# EAGLE design ATmega168 Temp Sensor - Remote Unit (EAGLE 5.06)
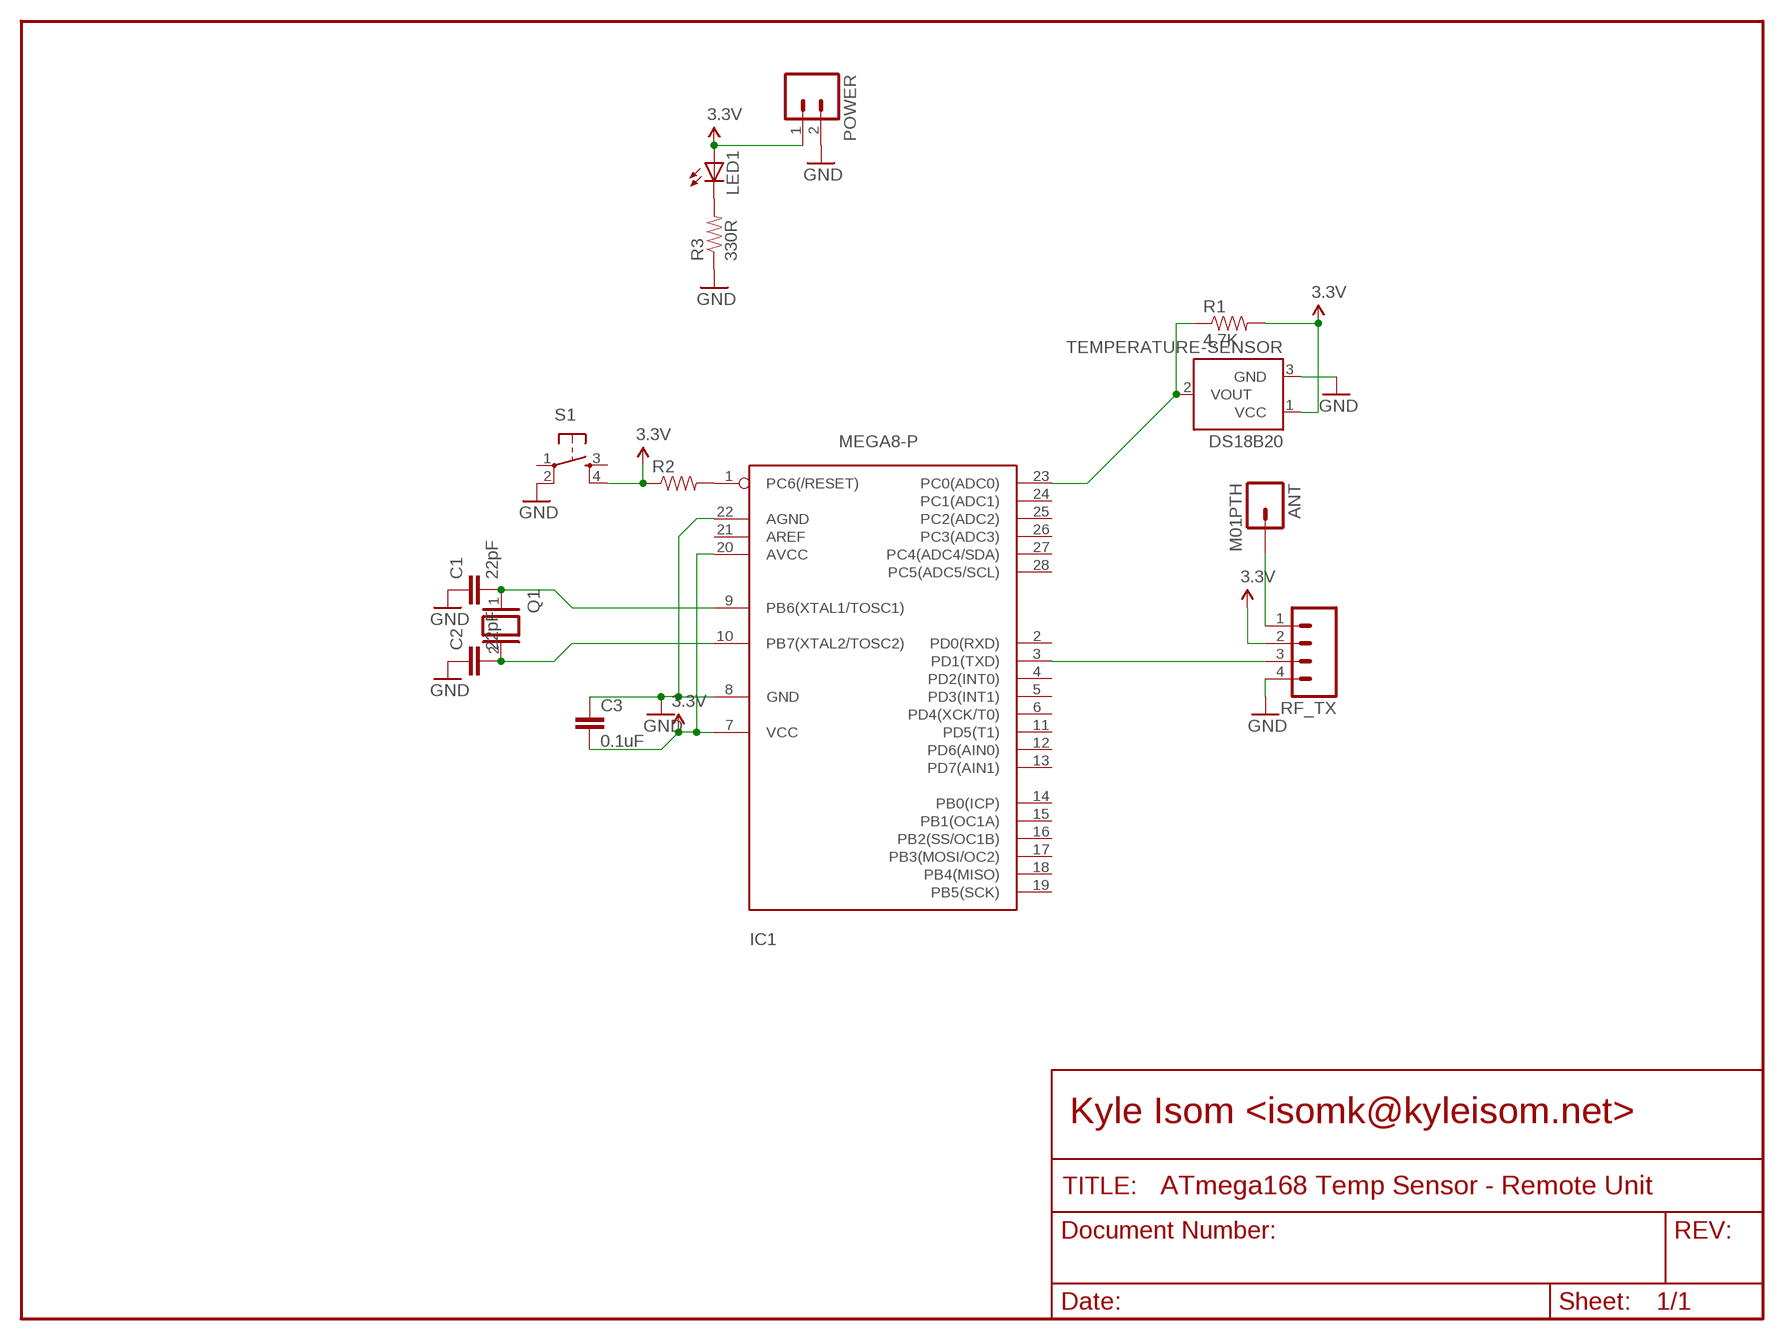
[diagram p0: schematic, sheet 1]

## Parts
ANT  M01PTH  [1X01]
C1  22pF  CAPPTH1  [CAP-PTH-5MM]
C2  22pF  CAPPTH1  [CAP-PTH-5MM]
C3  0.1uF  CAPPTH1  [CAP-PTH-5MM]
DS18B20  TEMPERATURE-SENSOR  [TO-92]
IC1  MEGA8-P  [DIL28-3]
LED1  LED3MM  [LED3MM]
POWER  M02LOCK  [1X02_LOCK]
Q1  XTAL/S  [QS]
R1  4.7K  RESISTORPTH1  [AXIAL-0.3]
R2  RESISTORPTH1  [AXIAL-0.3]
R3  330R  RESISTORPTH1  [AXIAL-0.3]
RF_TX  M04LOCK  [1X04_LOCK]
S1  TAC_SWITCHPTH  [TACTILE-PTH]

## Nets
3.3V: C3.2 DS18B20.1(VCC) IC1.7(VCC) IC1.20(AVCC) LED1.A POWER.1 R1.P$2 R2.P$1 RF_TX.2 S1.4
GND: C1.1 C2.1 C3.1 DS18B20.3(GND) IC1.8(GND) IC1.22(AGND) POWER.2 R3.P$1 RF_TX.4 S1.2
N$1: IC1.3(PD1(TXD)) RF_TX.3
N$2: C1.2 IC1.9(PB6(XTAL1/TOSC1)) Q1.1
N$3: C2.2 IC1.10(PB7(XTAL2/TOSC2)) Q1.2
N$4: ANT.1 RF_TX.1
N$5: IC1.1(PC6(/RESET)) R2.P$2
N$7: DS18B20.2(VOUT) IC1.23(PC0(ADC0)) R1.P$1
N$8: LED1.K(C) R3.P$2
Unconnected: IC1.2(PD0(RXD)) IC1.4(PD2(INT0)) IC1.5(PD3(INT1)) IC1.6(PD4(XCK/T0)) IC1.11(PD5(T1)) IC1.12(PD6(AIN0)) IC1.13(PD7(AIN1)) IC1.14(PB0(ICP)) IC1.15(PB1(OC1A)) IC1.16(PB2(SS/OC1B)) IC1.17(PB3(MOSI/OC2)) IC1.18(PB4(MISO)) IC1.19(PB5(SCK)) IC1.21(AREF) IC1.24(PC1(ADC1)) IC1.25(PC2(ADC2)) IC1.26(PC3(ADC3)) IC1.27(PC4(ADC4/SDA)) IC1.28(PC5(ADC5/SCL)) S1.1 S1.3

## Notes on the sheet
- Kyle Isom <isomk@kyleisom.net>

## Library data of the parts
ANT = SparkFun:M01: Header 1 Standard 1-pin 0.1" header. Use with straight break away headers (SKU : PRT-00116), right angle break away headers (PRT-00553), swiss pins (PRT-00743), machine pins (PRT-00117), and female headers (PRT-00115).
C1-C3 = SparkFun:CAP: Capacitor Standard 0603 ceramic capacitor, and 0.1" leaded capacitor.
DS18B20 = SparkFun:TEMPERATURE-SENSOR
IC1 = avr-6:MEGA8-P: MICROCONTROLLER 8 Kbytes FLASH 1 kbytes SRAM 512 bytes EEPROM USART 4-channel 10 bit ADC 2-channel 8 bit ADC
LED1 = led:LED: LED OSRAM: - CHIPLED LG R971, LG N971, LY N971, LG Q971, LY Q971, LO R971, LY R971 LH N974, LH R974 LS Q976, LO Q976, LY Q976 LO Q996 - Hyper CHIPLED LW Q18S LB Q993, LB Q99A, LB R99A - SideLED LS A670, LO A670, LY A670, LG A670, LP A670 LB A673, LV A673, LT A673, LW A673 LH A674 LY A675 LS A676, LA A676, LO A676, LY A676, LW A676 LS A679, LY A679, LG A679 - Hyper Micro SIDELED® LS Y876, LA Y876, LO Y876, LY Y876 LT Y87S - SmartLED LW L88C, LW L88S LB L89C, LB L89S, LG L890 LS L89K, LO L89K, LY L89K LS L896, LA L896, LO L896, LY L896 - TOPLED LS T670, LO T670, LY T670, LG T670, LP T670 LSG T670, LSP T670, LSY T670, LOP T670, LYG T670 LG T671, LOG T671, LSG T671 LB T673, LV T673, LT T673, LW T673 LH T674 LS T676, LA T676, LO T676, LY T676, LB T676, LH T676, LSB T676, LW T676 LB T67C, LV T67C, LT T67C, LS T67K, LO T67K, LY T67K, LW E67C LS E67B, LA E67B, LO E67B, LY E67B, LB E67C, LV E67C, LT E67C LW T67C LS T679, LY T679, LG T679 LS T770, LO T770, LY T770, LG T770, LP T770 LB T773, LV T773, LT T773, LW T773 LH T774 LS E675, LA E675, LY E675, LS T675 LS T776, LA T776, LO T776, LY T776, LB T776 LHGB T686 LT T68C, LB T68C - Hyper Mini TOPLED® LB M676 - Mini TOPLED Santana® LG M470 LS M47K, LO M47K, LY M47K Source: http://www.osram.convergy.de LUXEON: - LUMILED® LXK2-PW12-R00, LXK2-PW12-S00, LXK2-PW14-U00, LXK2-PW14-V00 LXK2-PM12-R00, LXK2-PM12-S00, LXK2-PM14-U00 LXK2-PE12-Q00, LXK2-PE12-R00, LXK2-PE12-S00, LXK2-PE14-T00, LXK2-PE14-U00 LXK2-PB12-K00, LXK2-PB12-L00, LXK2-PB12-M00, LXK2-PB14-N00, LXK2-PB14-P00, LXK2-PB14-Q00 LXK2-PR12-L00, LXK2-PR12-M00, LXK2-PR14-Q00, LXK2-PR14-R00 LXK2-PD12-Q00, LXK2-PD12-R00, LXK2-PD12-S00 LXK2-PH12-R00, LXK2-PH12-S00 LXK2-PL12-P00, LXK2-PL12-Q00, LXK2-PL12-R00 Source: www.luxeon.com KINGBRIGHT: KA-3528ASYC Source: www.kingbright.com
POWER = SparkFun:M02: Header 2 Standard 2-pin 0.1" header. Use with straight break away headers (SKU : PRT-00116), right angle break away headers (PRT-00553), swiss pins (PRT-00743), machine pins (PRT-00117), and female headers (PRT-00115). Molex polarized connector foot print use with SKU : PRT-08233 with associated crimp pins and housings.
Q1 = special:XTAL/S: CRYSTAL
R1-R3 = SparkFun:RESISTOR: Resistor Basic schematic elements and footprints for 0603, 1206, and PTH 1/10th watt (small) resistors.
RF_TX = SparkFun:M04: Header 4 Standard 4-pin 0.1" header. Use with straight break away headers (SKU : PRT-00116), right angle break away headers (PRT-00553), swiss pins (PRT-00743), machine pins (PRT-00117), and female headers (PRT-00115). Molex polarized connector foot print use with SKU : PRT-08231 with associated crimp pins and housings.
S1 = SparkFun:TAC_SWITCH: Momentary Switch Button commonly used for reset or general input. Spark Fun Electronics SKU : COM-00097

## Board
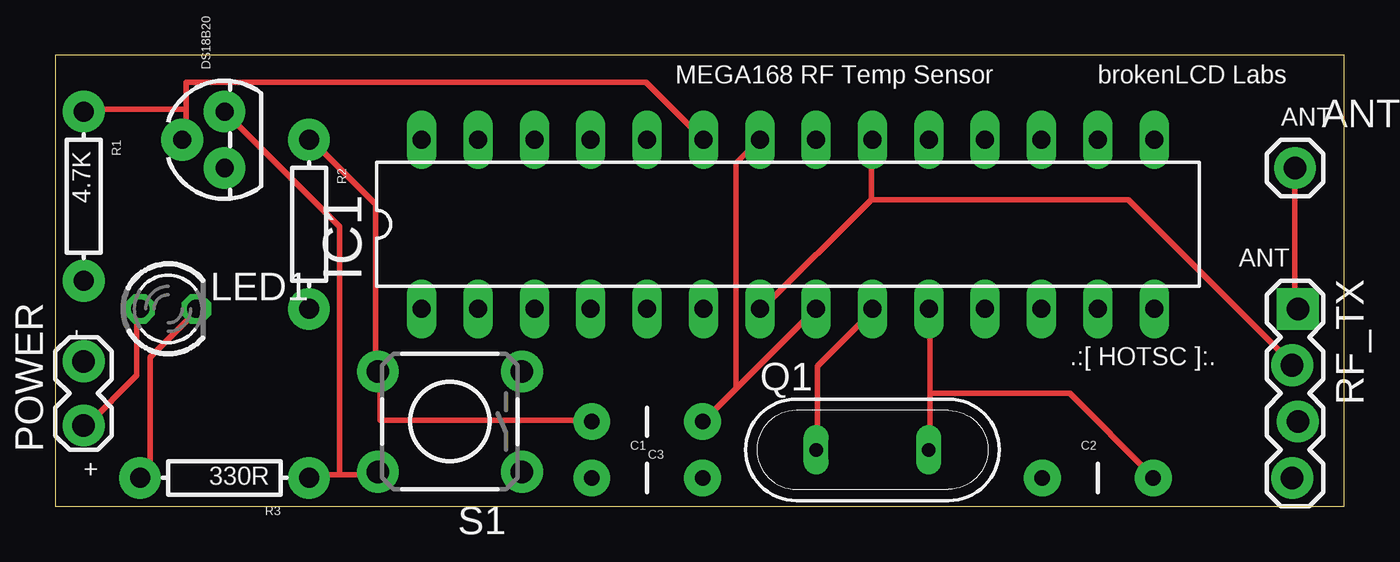
[diagram p1: board, top side]
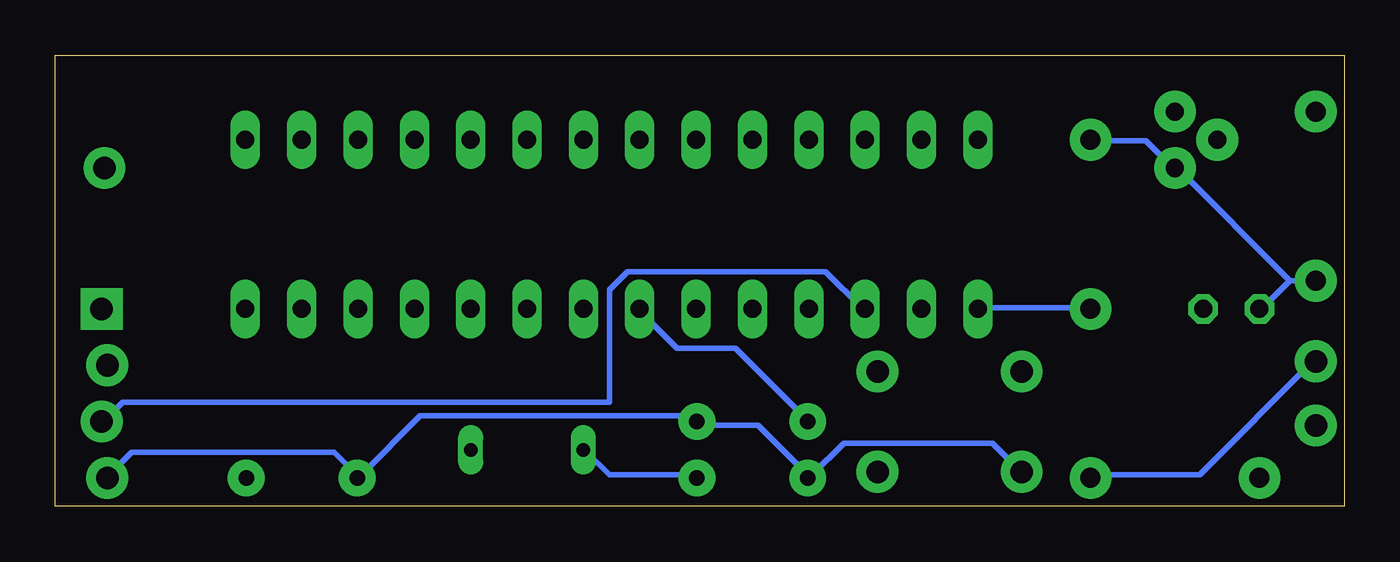
[diagram p2: board, bottom side, seen from below]

Size 58.09 x 20.31 mm. Coordinates in mm from the lower left corner, seen from the top.
Outline: 0,0 58.09,0 58.09,20.31 0,20.31 0,0
Copper layers (1*16): Top 0.035mm / dielectric 1.5mm / Bottom 0.035mm
Design rules "default": minimum track width 10mil, minimum drill 24mil, track to track 8mil, track to pad 8mil, pad to pad 8mil, via to via 8mil, smd to smd 8mil, copper to edge 40mil, drill to drill 8mil, minimum pad ring 10mil, minimum via ring 8mil, stop-mask expansion 4mil, vias tented up to drill 0mil, thermal gap 10mil

### Footprints (pad centres in the part's own frame; a part is rotated, then mirrored left to right if it is on the bottom)
1X01 = drill 1.016 pad 1.88 round: 1 0,0
CAP-PTH-5MM = drill 0.7 pad 1.651 round: 1 -2.5,0; 2 2.5,0
TO-92 = drill 0.813 pad 1.88 round: 1 -1.27,0; 2 0,1.905; 3 1.27,0
DIL28-3 = drill 0.813 long: 1 -16.51,-3.81; 2 -13.97,-3.81; 3 -11.43,-3.81; 4 -8.89,-3.81; 5 -6.35,-3.81; 6 -3.81,-3.81; 7 -1.27,-3.81; 8 1.27,-3.81; 9 3.81,-3.81; 10 6.35,-3.81; 11 8.89,-3.81; 12 11.43,-3.81; 13 13.97,-3.81; 14 16.51,-3.81; 15 16.51,3.81; 16 13.97,3.81; 17 11.43,3.81; 18 8.89,3.81; 19 6.35,3.81; 20 3.81,3.81; 21 1.27,3.81; 22 -1.27,3.81; 23 -3.81,3.81; 24 -6.35,3.81; 25 -8.89,3.81; 26 -11.43,3.81; 27 -13.97,3.81; 28 -16.51,3.81
LED3MM = drill 0.813 octagon: A -1.27,0; K 1.27,0
1X02_LOCK = drill 1.016 pad 1.88 round: 1 -0.178,0; 2 2.718,0
QS = drill 0.61 long: 1 -2.54,0; 2 2.54,0
AXIAL-0.3 = drill 0.9 pad 1.88 round: P$1 -3.81,0; P$2 3.81,0
1X04_LOCK = drill 1.016 pad 1.88 square: 1 0,0.127 | drill 1.016 pad 1.88 round: 2 2.54,-0.127; 3 5.08,0.127; 4 7.62,-0.127
TACTILE-PTH = drill 1.016 pad 1.88 round: 1 -3.251,2.261; 2 3.251,2.261; 3 -3.251,-2.261; 4 3.251,-2.261

### Placement (x,y rotation side)
ANT  55.88,15.24 0 top
C1  26.67,1.27 0 top
C2  46.99,1.27 0 top
C3  26.67,3.81 180 top
DS18B20  7.62,16.51 90 top
IC1  33.02,12.7 0 top
LED1  5.08,8.89 0 top
POWER  1.27,3.81 90 top
Q1  36.83,2.54 0 top
R1  1.27,13.97 270 top
R2  11.43,12.7 270 top
R3  7.62,1.27 180 top
RF_TX  55.88,8.89 270 top
S1  17.78,3.81 180 top

### Tracks (layer width: path | path; a pad name or v marks a point on that pad's centre or on a via)
3.3V
  Top 0.254: POWER.1 1.42,3.66 3.66,5.89 3.66,8.74 LED1.A | C3.2 23.98,3.86 14.63,3.86 14.63,5.89 S1.4 14.43,6.1 14.43,13.61 11.58,16.46 R2.P$1 | 36.78,13.82 31.9,8.94 IC1.7 | 36.78,13.82 36.78,16.46 IC1.20 | 36.78,13.82 48.36,13.82 55.68,6.5 RF_TX.2
  Bottom 0.254: R2.P$1 11.38,16.46 8.94,16.46 7.72,15.24 DS18B20.1 7.52,15.24 2.44,10.16 | 2.44,10.16 3.66,8.94 LED1.A | 2.44,10.16 R1.P$2 | C3.2 24.18,3.86 27.43,7.11 30.07,7.11 31.7,8.74 IC1.7
GND
  Top 0.254: 12.8,1.42 14.43,1.42 S1.2 | 12.8,1.42 11.58,1.42 R3.P$1 | 12.8,1.42 12.8,12.6 DS18B20.3 | 30.68,5.28 29.26,3.86 C3.1 | 30.68,5.28 IC1.8 | 30.68,5.28 30.68,15.44 IC1.22
  Bottom 0.254: POWER.2 1.42,6.5 6.5,1.42 11.38,1.42 R3.P$1 | RF_TX.4 55.68,1.42 54.66,2.44 45.52,2.44 44.5,1.42 C2.1 44.3,1.42 41.66,4.06 29.46,4.06 29.26,3.86 C3.1 29.06,3.66 26.42,3.66 24.18,1.42 C1.1 23.98,1.42 22.55,2.85 15.85,2.85 14.63,1.63 S1.2
N$1
  Bottom 0.254: IC1.3 21.74,8.94 23.37,10.57 32.31,10.57 33.12,9.75 33.12,4.67 55.07,4.67 55.88,3.86 RF_TX.3
N$2
  Top 0.254: IC1.9 36.78,8.74 34.34,6.3 34.34,2.64 Q1.1
  Bottom 0.254: Q1.1 34.14,2.44 33.12,1.42 29.26,1.42 C1.2
N$3
  Top 0.254: 39.42,5.08 39.42,8.74 IC1.10 | 39.42,5.08 39.42,2.64 Q1.2 | 39.42,5.08 45.72,5.08 49.38,1.42 C2.2
N$4
  Top 0.254: ANT.1 55.88,8.94 RF_TX.1
N$5
  Bottom 0.254: IC1.1 16.46,8.94 11.58,8.94 R2.P$2
N$7
  Top 0.254: 5.89,17.88 5.89,16.66 DS18B20.2 | 5.89,17.88 5.89,19.1 26.62,19.1 IC1.23 | 5.89,17.88 1.42,17.88 R1.P$1
N$8
  Top 0.254: LED1.K 6.3,8.74 4.27,6.71 4.27,1.83 3.86,1.42 R3.P$2

### Text on the board
tPlace: MEGA168 RF Temp Sensor | brokenLCD Labs | ANT | ANT | - | .:[ HOTSC ]:. | +